# EAGLE design Nametag (EAGLE 8.7.1)
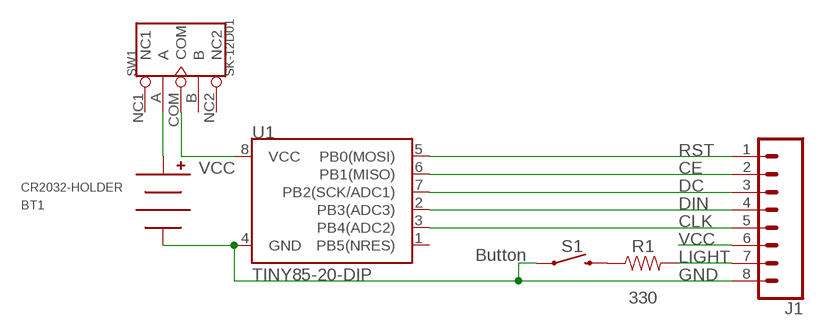
[diagram p0: schematic, sheet 1]

## Parts
BT1  CR2032-HOLDER  [CH28-2032LF]
J1  CONN_08"  [1X08]
R1  330  330OHM-HORIZ-1/10W-5%  [AXIAL-0.3]
S1  Button  MOMENTARY-SWITCH-SPST-PTH-6.0MM  [TACTILE_SWITCH_PTH_6.0MM]
SW1  SK-12D01  DIP-TOGGLE-SWITCH-ON-ON(3+2P-8.8X4.6MM)  [SW5-2.0-8.8X4.4X4.7MM-90D]
U1  TINY85-20-DIP  ATTINY45TINY85-20-DIP  [DIP08_MCU]

## Nets
CE: J1.2 U1.6(PB1(MISO))
CLK: J1.5 U1.3(PB4(ADC2))
DC: J1.3 U1.7(PB2(SCK/ADC1))
DIN: J1.4 U1.2(PB3(ADC3))
GND: BT1.NEG J1.8 S1.1 U1.4(GND)
LIGHT: J1.7 R1.P$2
N$1: R1.P$1 S1.3
N$7: BT1.POS SW1.A
RST: J1.1 U1.5(PB0(MOSI))
VCC: J1.6 SW1.COM U1.8(VCC)
Unconnected: SW1.B SW1.NC1 SW1.NC2 U1.1(PB5(NRES))

## Library data of the parts
BT1 = battery-holder:CR2032-HOLDER
J1 = SparkFun-Connectors:CONN_08: Multi connection point. Often used as Generic Header-pin footprint for 0.1 inch spaced/style header connections On any of the 0.1 inch spaced packages, you can populate with these: Break Away Headers - Straight <https://www.sparkfun.com/products/116> (PRT-00116) Break Away Male Headers - Right Angle <https://www.sparkfun.com/products/553> (PRT-00553) Female Headers <https://www.sparkfun.com/products/115> (PRT-00115) Break Away Headers - Machine Pin <https://www.sparkfun.com/products/117> (PRT-00117) Break Away Female Headers - Swiss Machine Pin <https://www.sparkfun.com/products/743> (PRT-00743) Arduino Stackable Header - 8 Pin <https://www.sparkfun.com/products/9279> (PRT-09279) For SCREWTERMINALS and SPRING TERMINALS visit here: Screw Terimnals on SparkFun.com <https://www.sparkfun.com/search/results?term=Screw+Terminals> (5mm/3.5mm/2.54mm spacing) This device is also useful as a general connection point to wire up your design to another part of your project. Our various solder wires solder well into these plated through hole pads. Hook-Up Wire - Assortment (Stranded, 22 AWG) <https://www.sparkfun.com/products/11375> (PRT-11375) Hook-Up Wire - Assortment (Solid Core, 22 AWG) <https://www.sparkfun.com/products/11367> (PRT-11367) View the entire wire category on our website here <https://www.sparkfun.com/categories/141> Special notes: Molex polarized connector foot print use with SKU : PRT-08231 with associated crimp pins and housings. 1MM SMD Version SKU: PRT-10208 NOTES ON THE VARIANTS LOCK and LOCK_LONGPADS... This footprint was designed to help hold the alignment of a through-hole component (i.e. 6-pin header) while soldering it into place. You may notice that each hole has been shifted either up or down by 0.005 of an inch from it's more standard position (which is a perfectly straight line). This slight alteration caused the pins (the squares in the middle) to touch the edges of the holes. Because they are alternating, it causes a "brace" to hold the component in place. 0.005 has proven to be the perfect amount of "off-center" position when using our standard breakaway headers. Although looks a little odd when you look at the bare footprint, once you have a header in there, the alteration is very hard to notice. Also,if you push a header all the way into place, it is covered up entirely on the bottom side.; PROD_ID: CONN-08438
R1 = SparkFun-Resistors:330OHM: 330Ω resistor A resistor is a passive two-terminal electrical component that implements electrical resistance as a circuit element. Resistors act to reduce current flow, and, at the same time, act to lower voltage levels within circuits. - Wikipedia; PROD_ID: RES-8371
S1 = SparkFun-Switches:MOMENTARY-SWITCH-SPST: Momentary Switch (Pushbutton) - SPST Normally-open (NO) SPST momentary switches (buttons, pushbuttons). Variants PTH-12MM - 12mm square, through-hole Momentary Pushbutton Switch - 12mm Square <https://www.sparkfun.com/products/9190> (COM-09190) PTH-6.0MM, PTH-6.0MM-KIT - 6.0mm square, through-hole Mini Pushbutton Switch <https://www.sparkfun.com/products/97> (COM-00097) KIT package intended for soldering kit's - only one side of pads' copper is exposed. PTH-RIGHT-ANGLE-KIT - Right-angle, through-hole Right Angle Tactile Button <https://www.sparkfun.com/products/10791> - Used on SparkFun BigTime Watch Kit <https://www.sparkfun.com/products/11734> SMD-12MM - 12mm square, surface-mount Tactile Button - SMD (12mm) <https://www.sparkfun.com/products/12993> (COM-12993) Used on SparkFun PicoBoard <https://www.sparkfun.com/products/11888> SMD-4.5MM - 4.5mm Square Trackball Switch Used on SparkFun Blackberry Trackballer Breakout <https://www.sparkfun.com/products/13169> SMD-4.6MMX2.8MM - 4.60mm x 2.80mm, surface mount Used on SparkFun SAMD21 Mini Breakout <https://www.sparkfun.com/products/13664> SMD-5.2MM, SMD-5.2-REDUNDANT - 5.2mm square, surface-mount Mini Pushbutton Switch - SMD <https://www.sparkfun.com/products/8720> (COM-08720) Used on Arduino Pro Mini <https://www.sparkfun.com/products/11114> REDUNDANT package connects both switch circuits together SMD-6.0X3.5MM - 6.0 x 3.5mm, surface mount Momentary Reset Switch SMD <https://www.sparkfun.com/products/8229> (COM-08229) SMD-6.2MM-TALL - 6.2mm square, surface mount Tactile Button - SMD (6mm) <https://www.sparkfun.com/products/12992> Used on SparkFun Digital Sandbox <https://www.sparkfun.com/products/12651> SMD-RIGHT-ANGLE - Right-angle, surface mount Used on SparkFun Block for Intel® Edison - Arduino <https://www.sparkfun.com/products/13036>; PROD_ID: SWCH-08441; SF_SKU: COM-00097
SW1 = Seeed-OPL-Button:DIP-TOGGLE-SWITCH-ON-ON(3+2P-8.8X4.6MM): 311030008; MPN: SK-12D01
U1 = SparkFun-Retired:ATTINY45: Atmel 8-pin 2/4/8kB flash uC Retired; PROD_ID: IC-09445

## Board
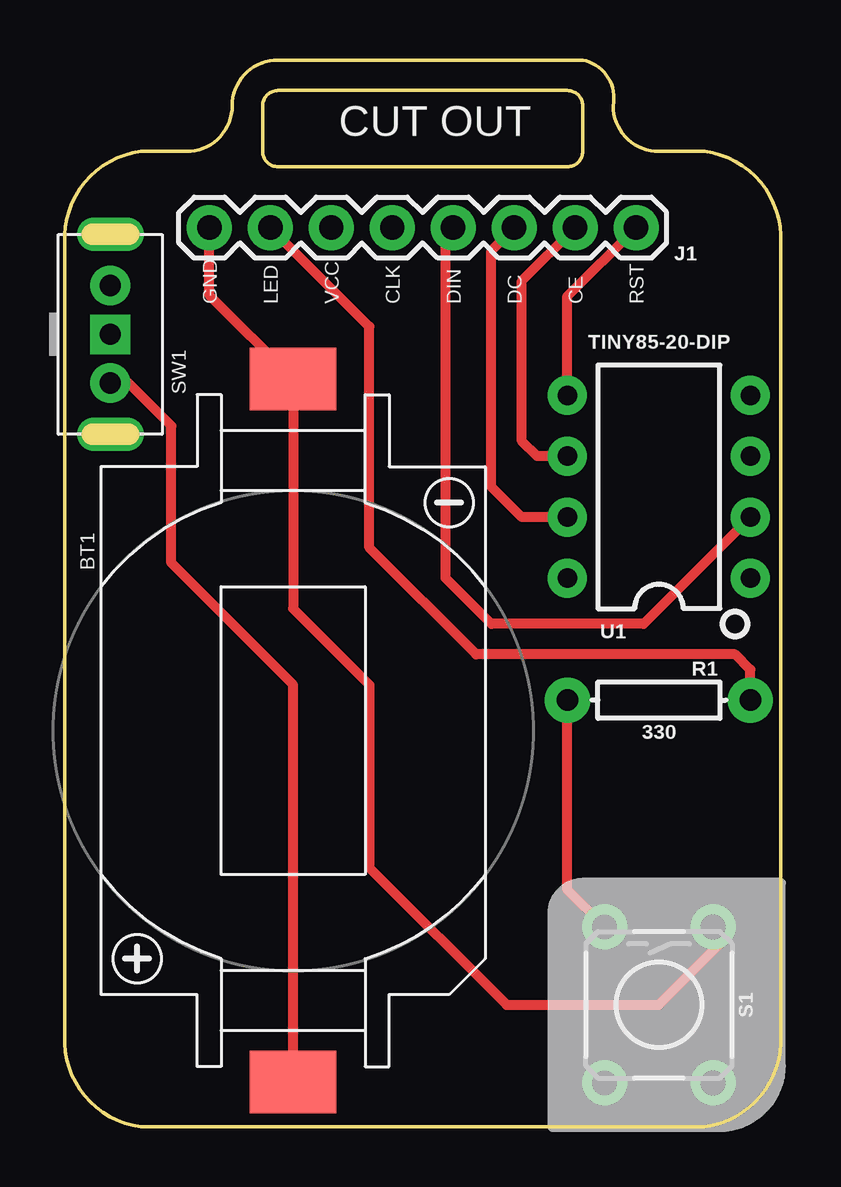
[diagram p1: board, top side]
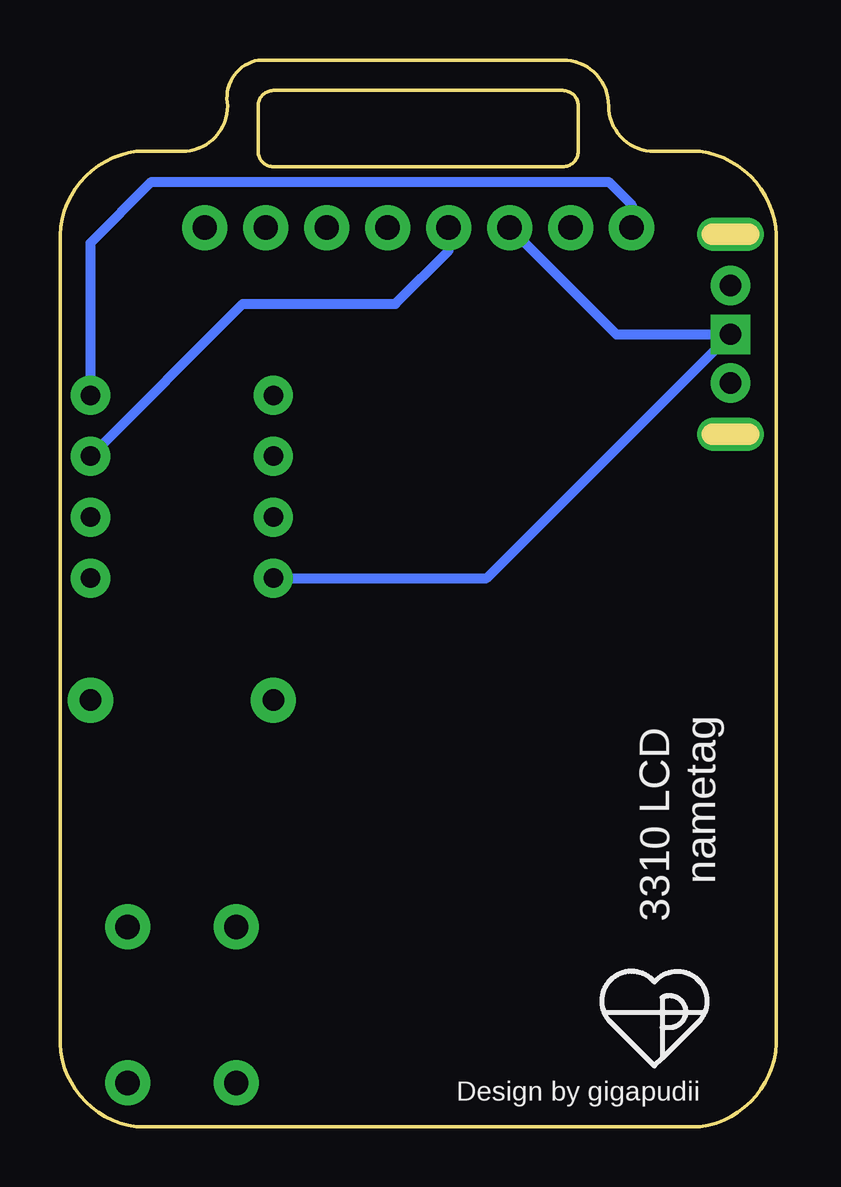
[diagram p2: board, bottom side, seen from below]

Size 29.85 x 44.45 mm. Coordinates in mm from the lower left corner, seen from the top.
Outline: 29.85,3.81 29.85,36.83 arc85 26.67,40.64 24.77,40.64 arc-90 22.86,42.55 arc90 21.59,44.45 8.89,44.45 arc90 6.99,42.55 arc-90 5.08,40.64 3.18,40.64 arc85 0,36.83 0,3.81 arc85 3.18,0 26.67,0 arc85 29.85,3.81
Outline: 8.26,42.55 8.26,40.64 arc90 8.89,40 20.96,40 arc90 21.59,40.64 21.59,42.55 arc90 20.96,43.18 8.89,43.18 arc90 8.26,42.55
Copper layers (1*16): Top 0.035mm / dielectric 1.5mm / Bottom 0.035mm
Design rules "SeeedStudio_2layer_DRU_edited": minimum track width 7mil, minimum drill 15mil, track to track 6mil, track to pad 6mil, pad to pad 6mil, via to via 6mil, smd to smd 0mil, copper to edge 10mil, drill to drill 10mil, minimum pad ring 10mil, minimum via ring 6mil, stop-mask expansion 2mil, vias tented up to drill 100mil, thermal gap 10mil
Milling: 8 lines

### Footprints (pad centres in the part's own frame; a part is rotated, then mirrored left to right if it is on the bottom)
CH28-2032LF = smd 3.6 x 2.6: NEG 0,-14.65; POS 0,14.65
1X08 = drill 1.016 pad 1.88: 1 0,0; 2 2.54,0; 3 5.08,0; 4 7.62,0; 5 10.16,0; 6 12.7,0; 7 15.24,0; 8 17.78,0
AXIAL-0.3 = drill 0.9 pad 1.88: P$1 -3.81,0; P$2 3.81,0
TACTILE_SWITCH_PTH_6.0MM = drill 1.016 pad 1.88: 1 -3.251,2.261; 2 3.251,2.261; 3 -3.251,-2.261; 4 3.251,-2.261
SW5-2.0-8.8X4.4X4.7MM-90D = drill 0.889 pad 1.651: A 0,2.032; B 0,-2.032 | drill 0.889 pad 1.651 square: COM 0,0 | drill 0.762 pad 1.397 long: NC1 0,4.166; NC2 0,-4.166
DIP08_MCU = drill 0.813 pad 1.626: 1 -3.81,-3.81; 2 -1.27,-3.81; 3 1.27,-3.81; 4 3.81,-3.81; 5 3.81,3.81; 6 1.27,3.81; 7 -1.27,3.81; 8 -3.81,3.81

### Placement (x,y rotation side)
BT1  9.53,16.51 180 top
J1  23.81,37.46 180 top
R1  24.77,17.78 0 top
S1  24.77,5.08 270 top
SW1  1.91,33.02 180 top
U1  24.77,26.67 90 top

### Tracks (layer width: path | path; a pad name or v marks a point on that pad's centre or on a via)
CE
  Top 0.406: U1.6 19.69,27.94 19.05,28.57 19.05,35.24 J1.2
CLK
  Bottom 0.406: U1.3 22.23,34.29 15.88,34.29 13.65,36.51 J1.5
DC
  Top 0.406: J1.3 17.78,36.51 17.78,26.67 19.05,25.4 U1.7
DIN
  Top 0.406: U1.2 24.13,20.96 17.78,20.96 15.88,22.86 15.88,37.15 J1.4
GND
  Top 0.406: 9.57,31.11 BT1.NEG | BT1.NEG 6.03,34.65 J1.8 | BT1.NEG 9.53,21.59 12.7,18.42 12.7,10.79 18.42,5.08 24.77,5.08 27.31,7.62 27.31,8.05 S1.1
  Bottom 0.406: U1.4 28.58,36.83 26.04,39.37 6.99,39.37 6.03,38.42 J1.8
LIGHT
  Top 0.406: R1.P$2 28.58,19.05 27.94,19.68 17.15,19.68 12.7,24.13 12.7,33.34 J1.7 8.57,37.78
N$1
  Top 0.406: S1.3 20.96,9.88 R1.P$1
N$7
  Top 0.406: BT1.POS 9.53,18.42 4.45,23.5 4.45,29.21 2.67,30.99 SW1.A
RST
  Top 0.406: U1.5 20.96,34.61 J1.1
VCC
  Bottom 0.406: SW1.COM 12.07,22.86 U1.8 | 2.54,32.39 SW1.COM | J1.6 6.67,33.02 SW1.COM

### Text on the board
tPlace: CUT OUT | GND | LED | VCC | CLK | DIN | DC | CE | RST
bPlace: 3310 LCD / nametag | Design by gigapudii